# Altium project roach2_project rev2.PrjPCB (part 4 of 13)

## Sheet ppc_extbus.SchDoc: PowerPC External Bus Interfaces
size A3; Date: DO NOT USE, RATHER USE PROJ OPTIONS; DrawnBy: DO NOT USE, RATHER USE PROJ OPTIONS; Engineer: DO NOT USE, RATHER USE PROJ OPTIONS; Organization: DO NOT USE, RATHER USE PROJ OPTIONS; DocumentNumber: DO NOT USE, RATHER USE PROJ OPTIONS; Revision: DO NOT USE, RATHER USE PROJ OPTIONS; SheetNumber: 6; SheetTotal: 29; SCH_Sheet_Filename: ppc_extbus.SchDoc; CurrentTime: DO NOT USE, RATHER USE PROJ OPTIONS; Time: DO NOT USE, RATHER USE PROJ OPTIONS; DocumentFullPathAndName: DO NOT USE, RATHER USE PROJ OPTIONS; DocumentName: DO NOT USE, RATHER USE PROJ OPTIONS; ModifiedDate: DO NOT USE, RATHER USE PROJ OPTIONS; ImagePath: DO NOT USE, RATHER USE PROJ OPTIONS
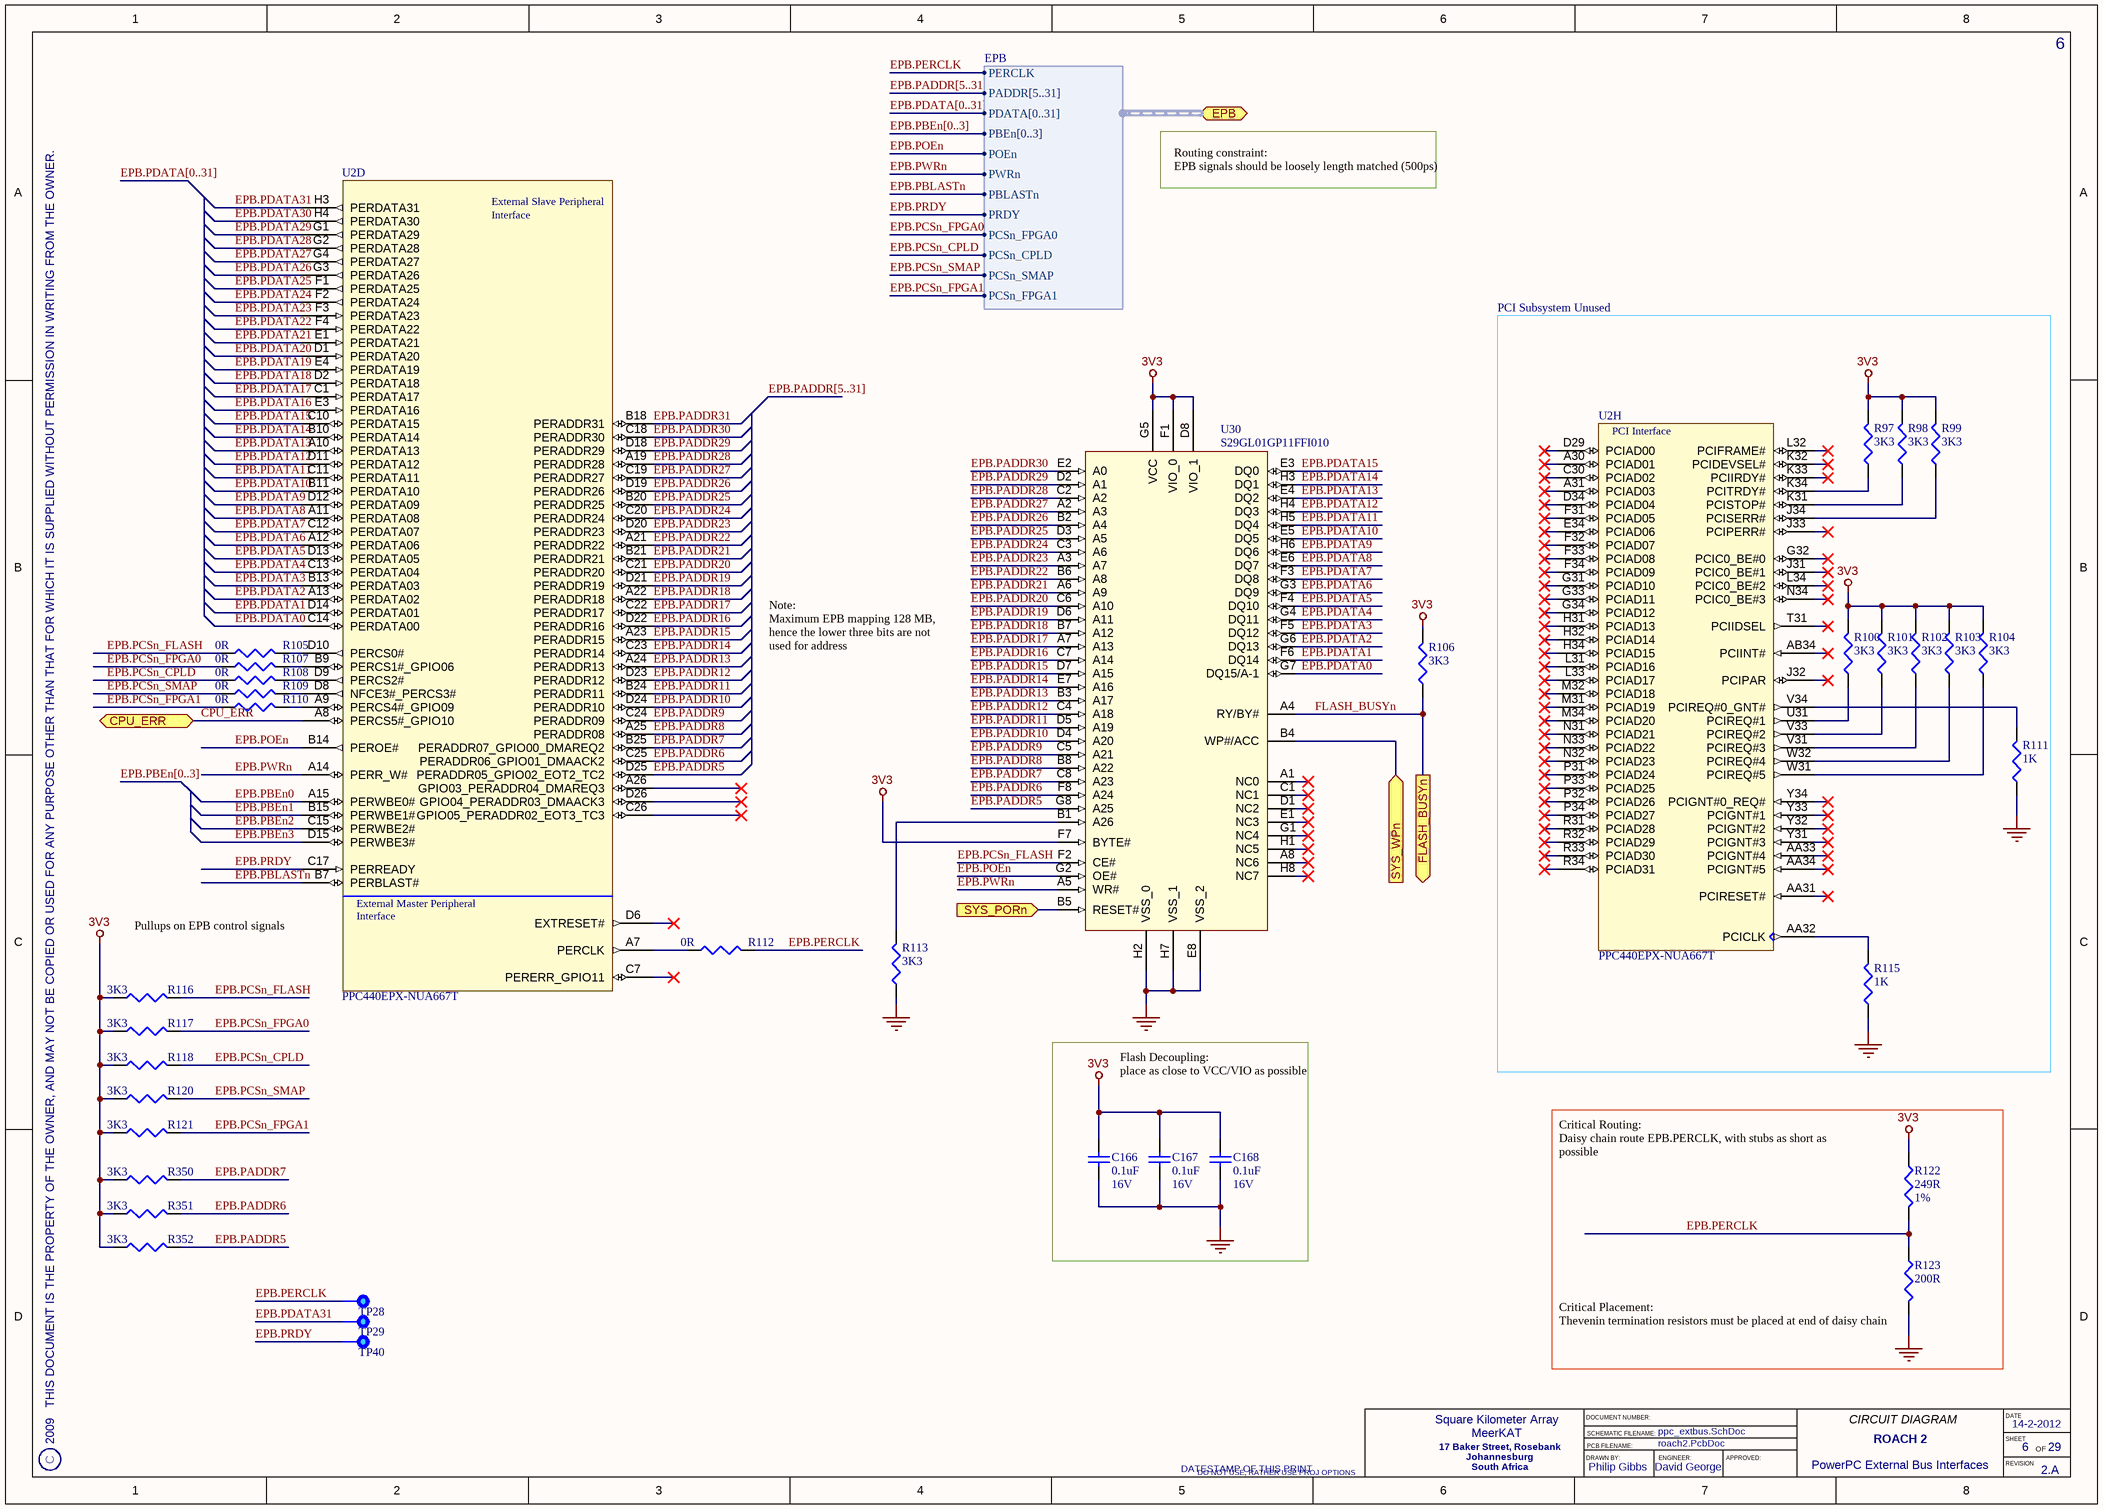
[diagram p7: ppc_extbus.SchDoc]

### Parts
C166  Rating: 16V  [CAPC1005X60L]  (hidden comment: 0.1uF)
C167  Rating: 16V  [CAPC1005X60L]  (hidden comment: 0.1uF)
C168  Rating: 16V  [CAPC1005X60L]  (hidden comment: 0.1uF)
R97  3K3  [RESC1005X40L]
R98  3K3  [RESC1005X40L]
R99  3K3  [RESC1005X40L]
R100  3K3  [RESC1005X40L]
R101  3K3  [RESC1005X40L]
R102  3K3  [RESC1005X40L]
R103  3K3  [RESC1005X40L]
R104  3K3  [RESC1005X40L]
R105  0R  [RESC1005X40L]
R106  3K3  [RESC1005X40L]
R107  0R  [RESC1005X40L]
R108  0R  [RESC1005X40L]
R109  0R  [RESC1005X40L]
R110  0R  [RESC1005X40L]
R111  1K  [RESC1005X40L]
R112  0R  [RESC1005X40L]
R113  3K3  [RESC1005X40L]
R115  1K  [RESC1005X40L]
R116  3K3  [RESC1005X40L]
R117  3K3  [RESC1005X40L]
R118  3K3  [RESC1005X40L]
R120  3K3  [RESC1005X40L]
R121  3K3  [RESC1005X40L]
R122  Tolerance: 1%  [RESC1005X40L]  (hidden comment: 249R)
R123  200R  [RESC1005X40L]
R350  3K3  [RESC1005X40L]
R351  3K3  [RESC1005X40L]
R352  3K3  [RESC1005X40L]
TP28  Testpoint  [TP100]  (value not drawn)  (no BOM)
TP29  Testpoint  [TP100]  (value not drawn)  (no BOM)
TP40  Testpoint  [TP100]  (value not drawn)  (no BOM)
U2  PPC440EPX-NUA667T  [TE-PBGA680]  (parts D,H of 11)
U30  S29GL01GP11FFI010  [LAA064]

### Blocks framed on the sheet
PCI Subsystem Unused: R97-R104 R111 R115 U2

### Ports
CPU_ERR (bidir), EPB (harness EPB), FLASH_BUSYn (out), SYS_PORn (in), SYS_WPn (in)

### Harnesses
EPB: PERCLK, PADDR[5..31], PDATA[0..31], PBEn[0..3], POEn, PWRn, PBLASTn, PRDY, PCSn_FPGA0, PCSn_CPLD, PCSn_SMAP, PCSn_FPGA1

### Nets
3V3: C166.2 C167.2 C168.2 R97.2 R98.2 R99.2 R100.2 R101.2 R102.2 R103.2 R104.2 R106.2 R116.1 R117.1 R118.1 R120.1 R121.1 R122.1 R350.1 R351.1 R352.1 U30.D8(VIO_1) U30.F1(VIO_0) U30.F7(BYTE#) U30.G5(VCC)
GND: C166.1 C167.1 C168.1 R111.1 R113.1 R115.1 R123.2 U30.E8(VSS_2) U30.H2(VSS_0) U30.H7(VSS_1)
CPU_ERR: U2.A8(PERCS5#_GPIO10) ; port CPU_ERR
EPB.PADDR5: R352.2 U2.D25(PERADDR05_GPIO02_EOT2_TC2) U30.G8(A25)
EPB.PADDR6: R351.2 U2.C25(PERADDR06_GPIO01_DMAACK2) U30.F8(A24)
EPB.PADDR7: R350.2 U2.B25(PERADDR07_GPIO00_DMAREQ2) U30.C8(A23)
EPB.PADDR8: U2.A25(PERADDR08) U30.B8(A22)
EPB.PADDR9: U2.C24(PERADDR09) U30.C5(A21)
EPB.PADDR10: U2.D24(PERADDR10) U30.D4(A20)
EPB.PADDR11: U2.B24(PERADDR11) U30.D5(A19)
EPB.PADDR12: U2.D23(PERADDR12) U30.C4(A18)
EPB.PADDR13: U2.A24(PERADDR13) U30.B3(A17)
EPB.PADDR14: U2.C23(PERADDR14) U30.E7(A16)
EPB.PADDR15: U2.A23(PERADDR15) U30.D7(A15)
EPB.PADDR16: U2.D22(PERADDR16) U30.C7(A14)
EPB.PADDR17: U2.C22(PERADDR17) U30.A7(A13)
EPB.PADDR18: U2.A22(PERADDR18) U30.B7(A12)
EPB.PADDR19: U2.D21(PERADDR19) U30.D6(A11)
EPB.PADDR20: U2.C21(PERADDR20) U30.C6(A10)
EPB.PADDR21: U2.B21(PERADDR21) U30.A6(A9)
EPB.PADDR22: U2.A21(PERADDR22) U30.B6(A8)
EPB.PADDR23: U2.D20(PERADDR23) U30.A3(A7)
EPB.PADDR24: U2.C20(PERADDR24) U30.C3(A6)
EPB.PADDR25: U2.B20(PERADDR25) U30.D3(A5)
EPB.PADDR26: U2.D19(PERADDR26) U30.B2(A4)
EPB.PADDR27: U2.C19(PERADDR27) U30.A2(A3)
EPB.PADDR28: U2.A19(PERADDR28) U30.C2(A2)
EPB.PADDR29: U2.D18(PERADDR29) U30.D2(A1)
EPB.PADDR30: U2.C18(PERADDR30) U30.E2(A0)
EPB.PADDR31: U2.B18(PERADDR31)
EPB.PBEn0: U2.A15(PERWBE0#)
EPB.PBEn1: U2.B15(PERWBE1#)
EPB.PBEn2: U2.C15(PERWBE2#)
EPB.PBEn3: U2.D15(PERWBE3#)
EPB.PBLASTn: U2.B7(PERBLAST#) ; port EPB.PBLASTn
EPB.PCSn_CPLD: R108.1 R118.2 ; port EPB.PCSn_CPLD
EPB.PCSn_FLASH: R105.1 R116.2 U30.F2(CE#)
EPB.PCSn_FPGA0: R107.1 R117.2 ; port EPB.PCSn_FPGA0
EPB.PCSn_FPGA1: R110.1 R121.2 ; port EPB.PCSn_FPGA1
EPB.PCSn_SMAP: R109.1 R120.2 ; port EPB.PCSn_SMAP
EPB.PDATA0: U2.C14(PERDATA00) U30.G7(DQ15/A-1)
EPB.PDATA1: U2.D14(PERDATA01) U30.F6(DQ14)
EPB.PDATA2: U2.A13(PERDATA02) U30.G6(DQ13)
EPB.PDATA3: U2.B13(PERDATA03) U30.F5(DQ12)
EPB.PDATA4: U2.C13(PERDATA04) U30.G4(DQ11)
EPB.PDATA5: U2.D13(PERDATA05) U30.F4(DQ10)
EPB.PDATA6: U2.A12(PERDATA06) U30.G3(DQ9)
EPB.PDATA7: U2.C12(PERDATA07) U30.F3(DQ8)
EPB.PDATA8: U2.A11(PERDATA08) U30.E6(DQ7)
EPB.PDATA9: U2.D12(PERDATA09) U30.H6(DQ6)
EPB.PDATA10: U2.B11(PERDATA10) U30.E5(DQ5)
EPB.PDATA11: U2.C11(PERDATA11) U30.H5(DQ4)
EPB.PDATA12: U2.D11(PERDATA12) U30.H4(DQ3)
EPB.PDATA13: U2.A10(PERDATA13) U30.E4(DQ2)
EPB.PDATA14: U2.B10(PERDATA14) U30.H3(DQ1)
EPB.PDATA15: U2.C10(PERDATA15) U30.E3(DQ0)
EPB.PDATA16: U2.E3(PERDATA16)
EPB.PDATA17: U2.C1(PERDATA17)
EPB.PDATA18: U2.D2(PERDATA18)
EPB.PDATA19: U2.E4(PERDATA19)
EPB.PDATA20: U2.D1(PERDATA20)
EPB.PDATA21: U2.E1(PERDATA21)
EPB.PDATA22: U2.F4(PERDATA22)
EPB.PDATA23: U2.F3(PERDATA23)
EPB.PDATA24: U2.F2(PERDATA24)
EPB.PDATA25: U2.F1(PERDATA25)
EPB.PDATA26: U2.G3(PERDATA26)
EPB.PDATA27: U2.G4(PERDATA27)
EPB.PDATA28: U2.G2(PERDATA28)
EPB.PDATA29: U2.G1(PERDATA29)
EPB.PDATA30: U2.H4(PERDATA30)
EPB.PDATA31: TP29.1 U2.H3(PERDATA31)
EPB.PERCLK: R112.2 R122.2 R123.1 TP28.1 ; port EPB.PERCLK
EPB.POEn: U2.B14(PEROE#) U30.G2(OE#) ; port EPB.POEn
EPB.PRDY: TP40.1 U2.C17(PERREADY) ; port EPB.PRDY
EPB.PWRn: U2.A14(PERR_W#) U30.A5(WR#) ; port EPB.PWRn
FLASH_BUSYn: R106.1 U30.A4(RY/BY#) ; port FLASH_BUSYn
SYS_PORn: U30.B5(RESET#) ; port SYS_PORn
SYS_WPn: U30.B4(WP#/ACC) ; port SYS_WPn
NetR97_1: R97.1 U2.K34(PCITRDY#)
NetR98_1: R98.1 U2.K31(PCISTOP#)
NetR99_1: R99.1 U2.J34(PCISERR#)
NetR100_1: R100.1 U2.U31(PCIREQ#1)
NetR101_1: R101.1 U2.V33(PCIREQ#2)
NetR102_1: R102.1 U2.V31(PCIREQ#3)
NetR103_1: R103.1 U2.W32(PCIREQ#4)
NetR104_1: R104.1 U2.W31(PCIREQ#5)
NetR105_2: R105.2 U2.D10(PERCS0#)
NetR107_2: R107.2 U2.B9(PERCS1#_GPIO06)
NetR108_2: R108.2 U2.D9(PERCS2#)
NetR109_2: R109.2 U2.D8(NFCE3#_PERCS3#)
NetR110_2: R110.2 U2.A9(PERCS4#_GPIO09)
NetR111_2: R111.2 U2.V34(PCIREQ#0_GNT#)
NetR112_1: R112.1 U2.A7(PERCLK)
NetR113_2: R113.2 U30.B1(A26)
NetR115_2: R115.2 U2.AA32(PCICLK)

Not connected (* = marked no-connect by the designer): U2 A26(GPIO03_PERADDR04_DMAREQ3)* A30(PCIAD01)* A31(PCIAD03)* AA31(PCIRESET#)* AA33(PCIGNT#4)* AA34(PCIGNT#5)* AB34(PCIINT#)* C7(PERERR_GPIO11)* C26(GPIO05_PERADDR02_EOT3_TC3)* C30(PCIAD02)* D6(EXTRESET#)* D26(GPIO04_PERADDR03_DMAACK3)* D29(PCIAD00)* D34(PCIAD04)* E34(PCIAD06)* F31(PCIAD05)* F32(PCIAD07)* F33(PCIAD08)* F34(PCIAD09)* G31(PCIAD10)* G32(PCIC0_BE#0)* G33(PCIAD11)* G34(PCIAD12)* H31(PCIAD13)* H32(PCIAD14)* H34(PCIAD15)* J31(PCIC0_BE#1)* J32(PCIPAR)* J33(PCIPERR#)* K32(PCIDEVSEL#)* K33(PCIIRDY#)* L31(PCIAD16)* L32(PCIFRAME#)* L33(PCIAD17)* L34(PCIC0_BE#2)* M31(PCIAD19)* M32(PCIAD18)* M34(PCIAD20)* N31(PCIAD21)* N32(PCIAD23)* N33(PCIAD22)* N34(PCIC0_BE#3)* P31(PCIAD24)* P32(PCIAD26)* P33(PCIAD25)* P34(PCIAD27)* R31(PCIAD28)* R32(PCIAD29)* R33(PCIAD30)* R34(PCIAD31)* T31(PCIIDSEL)* Y31(PCIGNT#3)* Y32(PCIGNT#2)* Y33(PCIGNT#1)* Y34(PCIGNT#0_REQ#)*; U30 A1(NC0)* A8(NC6)* C1(NC1)* D1(NC2)* E1(NC3)* G1(NC4)* H1(NC5)* H8(NC7)*

### Buses and harness runs
bus EPB.PADDR[5..31]
bus EPB.PBEn[0..3]
bus EPB.PDATA[0..31]

### Notes on the sheet
- Routing constraint:
  EPB signals should be loosely length matched (500ps)
- Note:
  Maximum EPB mapping 128 MB,
  hence the lower three bits are not
  used for address
- (near U2) Pullups on EPB control signals
- Flash Decoupling:
  place as close to VCC/VIO as possible
- (near R122) Critical Routing:
  Daisy chain route EPB.PERCLK, with stubs as short as possible
- (near R123) Critical Placement:
  Thevenin termination resistors must be placed at end of daisy chain
- 2009   THIS DOCUMENT IS THE PROPERTY OF THE OWNER, AND MAY NOT BE COPIED OR USED FOR ANY PURPOSE OTHER THAN THAT FOR WHICH IT IS SUPPLIED WITHOUT PERMISSION IN WRITING FROM THE OWNER.
- C
- DATESTAMP OF THIS PRINT
- DRAWN BY:
- DOCUMENT NUMBER:
- SCHEMATIC FILENAME:
- PCB FILENAME:
- ENGINEER:
- APPROVED:
- CIRCUIT DIAGRAM
- DATE
- SHEET
- REVISION
- OF
- (in symbol IC-CPU-1, part D) External Slave Peripheral; Interface; External Master Peripheral
- (in symbol IC-CPU-1, part H) PCI Interface

### Library data of the parts
C166-C168 = CAP-CER-1: as C53 on sheet jtag_levelxlate; POD number: CAP-CER-1; RoHS: Y; Value: 0.1uF; Sort Value: 0.1; Category: Capacitors; Subcategory: Ceramic
R97-R104 R106 R113 R116-R118 R120 R121 R350-R352 = RES-TF-7: as R49 on sheet jtag_levelxlate; POD number: RES-TF-7; Value: 3K3; Sort Value: 3300; Category: Resistors; Subcategory: ThickFilm; HelpURL: *.pdf
R105 R107-R110 R112 = RES-TF-0: as R462-R467 on sheet jtag_levelxlate; POD number: RES-TF-0; Value: 0R; Sort Value: 0; Category: Resistors; Subcategory: ThickFilm; HelpURL: *.pdf
R111 R115 = RES-TF-8: 1K, 1.1mm x 0.5mm, Thick Film Resistor; Manufacturer: ROYALOHM; PartNum: 0402WGJ0102T1E; Tolerance: 5%; Rating: 0.0625W; POD number: RES-TF-8; Value: 1K; Sort Value: 1000; Category: Resistors; Subcategory: ThickFilm; HelpURL: *.pdf
R122 = RES-TF-15: 249R, 1.1mm x 0.5mm, Thick Film Resistor; Manufacturer: ROYALOHM; PartNum: 0402WGF2490T1E; Rating: 0.0625W; POD number: RES-TF-15; Value: 249R; Sort Value: 249; Category: Resistors; Subcategory: ThickFilm; HelpURL: *.pdf
R123 = RES-TF-19: as R51 on sheet ppc_cpld; POD number: RES-TF-19; Value: 200R; Sort Value: 200; Category: Resistors; Subcategory: ThickFilm; HelpURL: *.pdf
TP28 TP29 TP40 = ELMECH-TP-0: as TP41-TP43 on sheet jtag_levelxlate; POD number: ELMECH-TP-0; RoHS: Y; Category: ELMECH; Subcategory: Test Points
U2 = IC-CPU-1: 667MHz, non-RoHS, PPC440EPx uProcessor; Manufacturer: Applied Micro; POD number: IC-CPU-1; PartNum: PPC440EPX-NUA667T; RoHS: Y; Category: IC; Subcategory: CPU
U30 = IC-MEM-0: 3V, 1 Gigabit NOR Flash; Manufacturer: Spansion; POD number: IC-MEM-0; PartNum: S29GL01GP11FFI010; RoHS: Y; Category: IC; Subcategory: Memory